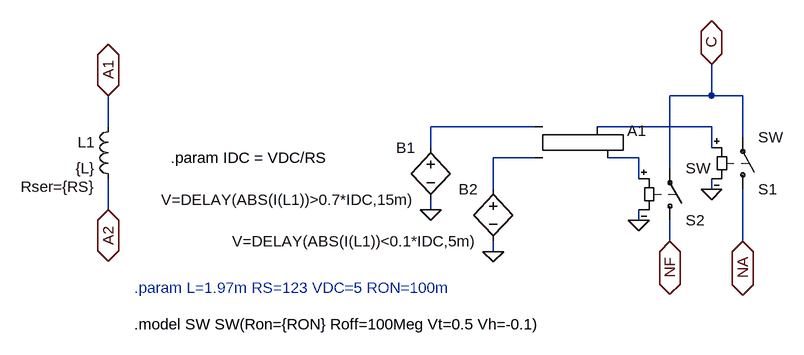
[diagram p0: schematic relaySPDT.asc]
relaySPDT.asc, the LTspice schematic file:
Version 4
SHEET 1 1288 680
WIRE 992 96 992 48
WIRE 992 96 928 96
WIRE 1040 96 992 96
WIRE 64 144 64 96
WIRE 720 144 560 144
WIRE 992 144 816 144
WIRE 1040 160 1040 96
WIRE 560 176 560 144
WIRE 992 176 992 144
WIRE 720 192 656 192
WIRE 880 192 832 192
WIRE 928 208 928 96
WIRE 880 224 880 192
WIRE 656 240 656 192
WIRE 992 240 992 224
WIRE 64 272 64 224
WIRE 560 272 560 256
WIRE 880 288 880 272
WIRE 928 320 928 288
WIRE 1040 320 1040 240
WIRE 656 336 656 320
FLAG 64 96 A1
IOPIN 64 96 BiDir
FLAG 64 272 A2
IOPIN 64 272 BiDir
FLAG 560 272 0
FLAG 992 240 0
FLAG 992 48 C
IOPIN 992 48 BiDir
FLAG 1040 320 NA
IOPIN 1040 320 BiDir
FLAG 656 336 0
FLAG 880 288 0
FLAG 928 320 NF
IOPIN 928 320 BiDir
SYMBOL ind 80 128 M0
WINDOW 39 36 108 Left 2
SYMATTR SpiceLine Rser={RS}
SYMATTR InstName L1
SYMATTR Value {L}
SYMBOL bv 560 160 M0
SYMATTR InstName B1
SYMATTR Value V=DELAY(ABS(I(L1))>0.7*IDC,15m)
SYMBOL sw 1040 256 M180
SYMATTR InstName S1
SYMBOL Digital\\srflop 768 96 R0
SYMATTR InstName A1
SYMBOL bv 656 224 M0
SYMATTR InstName B2
SYMATTR Value V=DELAY(ABS(I(L1))<0.1*IDC,5m)
SYMBOL sw 928 304 M180
SYMATTR InstName S2
TEXT 104 392 Left 2 ;.param L=1.97m RS=123 VDC=5 RON=100m
TEXT 104 448 Left 2 !.model SW SW(Ron={RON} Roff=100Meg Vt=0.5 Vh=-0.1)
TEXT 160 192 Left 2 !.param IDC = VDC/RS

The netlist it stands for:
* relaySPDT.asc
L1 A1 A2 {L} Rser={RS}
B1 N001 0 V=DELAY(ABS(I(L1))>0.7*IDC,15m)
S1 NA C N002 0 SW
A1 N001 N003 0 0 0 N004 N002 0 SRFLOP
B2 N003 0 V=DELAY(ABS(I(L1))<0.1*IDC,5m)
S2 NF C N004 0 SW
* .param L=1.97m RS=123 VDC=5 RON=100m
.model SW SW(Ron={RON} Roff=100Meg Vt=0.5 Vh=-0.1)
.param IDC = VDC/RS
.backanno
.end